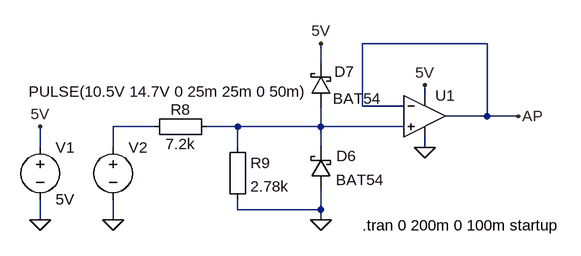
[diagram p0: schematic vbat.asc]
vbat.asc, the LTspice schematic file:
Version 4
SHEET 1 2360 708
WIRE 320 -768 128 -768
WIRE 64 -736 64 -768
WIRE 224 -688 224 -704
WIRE 128 -672 128 -768
WIRE 192 -672 128 -672
WIRE 320 -656 320 -768
WIRE 320 -656 256 -656
WIRE 368 -656 320 -656
WIRE -192 -640 -256 -640
WIRE -64 -640 -112 -640
WIRE 64 -640 64 -672
WIRE 64 -640 -64 -640
WIRE 192 -640 64 -640
WIRE -368 -608 -368 -640
WIRE -256 -608 -256 -640
WIRE -64 -608 -64 -640
WIRE 64 -608 64 -640
WIRE 224 -608 224 -624
WIRE -64 -512 -64 -528
WIRE 64 -512 64 -544
WIRE 64 -512 -64 -512
WIRE -368 -496 -368 -528
WIRE -256 -496 -256 -528
WIRE 64 -496 64 -512
FLAG -256 -496 0
FLAG 368 -656 AP
FLAG 64 -496 0
FLAG 64 -768 5V
FLAG 224 -704 5V
FLAG 224 -608 0
FLAG -368 -496 0
FLAG -368 -640 5V
SYMBOL voltage -256 -624 R0
WINDOW 3 -130 -70 Left 2
WINDOW 123 0 0 Left 2
WINDOW 39 0 0 Left 2
SYMATTR Value PULSE(10.5V 14.7V 0 25m 25m 0 50m)
SYMATTR InstName V2
SYMBOL schottky 80 -544 R180
WINDOW 0 -8 51 Right 2
WINDOW 3 -7 14 Right 2
SYMATTR InstName D6
SYMATTR Value BAT54
SYMATTR Description Zener Diode
SYMATTR Type zener
SYMBOL Misc\\EuropeanResistor -208 -624 R270
WINDOW 0 27 56 VTop 2
WINDOW 3 5 56 VBottom 2
SYMATTR InstName R8
SYMATTR Value 7.2k
SYMBOL schottky 80 -672 R180
WINDOW 0 -5 53 Right 2
WINDOW 3 -3 11 Right 2
SYMATTR InstName D7
SYMATTR Value BAT54
SYMATTR Description Zener Diode
SYMATTR Type zener
SYMBOL Misc\\EuropeanResistor -80 -624 R0
SYMATTR InstName R9
SYMATTR Value 2.78k
SYMBOL Opamps\\UniversalOpamp2 224 -656 R0
SYMATTR InstName U1
SYMBOL voltage -368 -624 R0
SYMATTR InstName V1
SYMATTR Value 5V
TEXT 128 -488 Left 2 !.tran 0 200m 0 100m startup

The netlist it stands for:
* vbat.asc
V2 N001 0 PULSE(10.5V 14.7V 0 25m 25m 0 50m)
D6 0 N002 BAT54
R8 N001 N002 7.2k
D7 N002 5V BAT54
R9 N002 0 2.78k
XU1 N002 AP 5V 0 AP level.2 Avol=1Meg GBW=10Meg Slew=10Meg ilimit=25m rail=0 Vos=0 phimargin=45 en=0 enk=0 in=0 ink=0 Rin=500Meg  ; pins IN+ IN- V+ V- OUT
V1 5V 0 5V
.model D D
.lib standard.dio
.tran 0 200m 0 100m startup
.lib UniversalOpamps2.sub
.backanno
.end